# Altium schematic sheet ANALOG_INPUT.SchDoc
size C
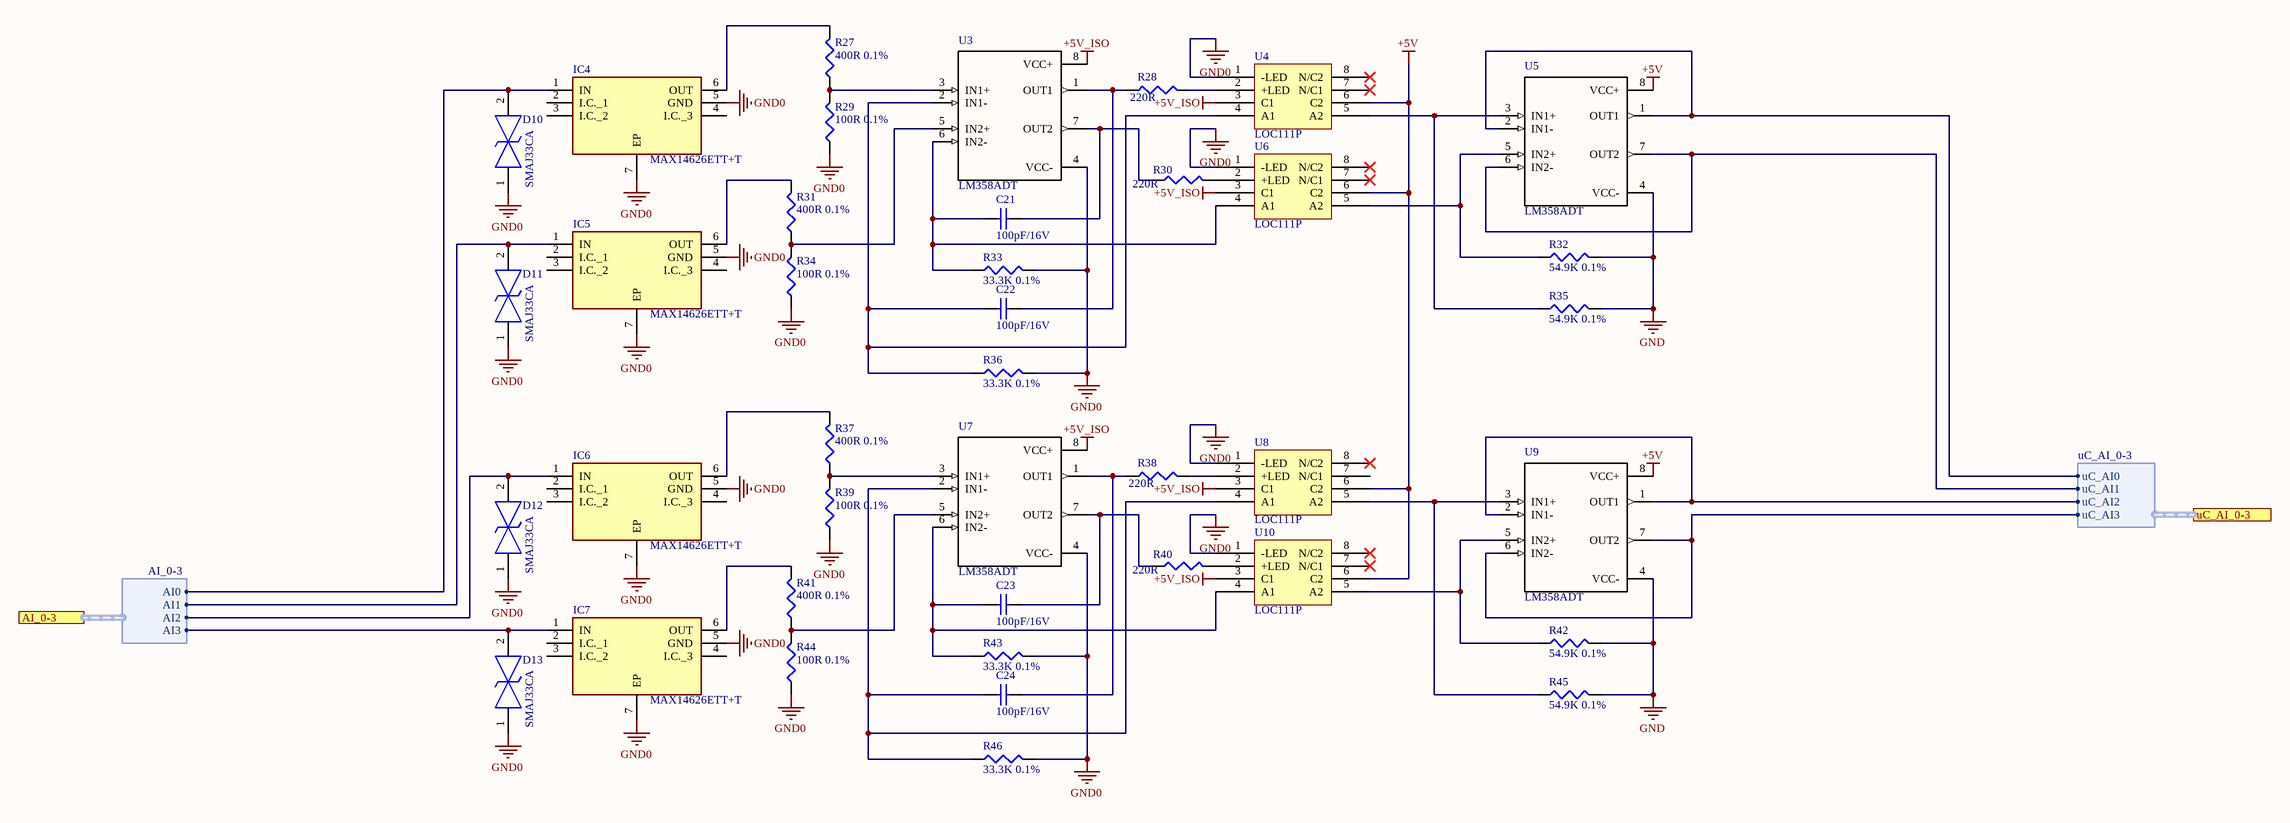
[diagram p0: ANALOG_INPUT.SchDoc]

## Parts
C21  100pF/16V  [1608[0603]]
C22  100pF/16V  [1608[0603]]
C23  100pF/16V  [1608[0603]]
C24  100pF/16V  [1608[0603]]
D10  SMAJ33CA  [DIONM5126X250N]
D11  SMAJ33CA  [DIONM5126X250N]
D12  SMAJ33CA  [DIONM5126X250N]
D13  SMAJ33CA  [DIONM5126X250N]
IC4  MAX14626ETT+T  [SON95P300X300X80-7N]
IC5  MAX14626ETT+T  [SON95P300X300X80-7N]
IC6  MAX14626ETT+T  [SON95P300X300X80-7N]
IC7  MAX14626ETT+T  [SON95P300X300X80-7N]
R27  400R 0.1%  [C1206]
R28  220R  [J1-0603]
R29  100R 0.1%  [C1206]
R30  220R  [J1-0603]
R31  400R 0.1%  [C1206]
R32  54.9K 0.1%  [J1-0603]
R33  33.3K 0.1%  [J1-0603]
R34  100R 0.1%  [C1206]
R35  54.9K 0.1%  [J1-0603]
R36  33.3K 0.1%  [J1-0603]
R37  400R 0.1%  [C1206]
R38  220R  [J1-0603]
R39  100R 0.1%  [C1206]
R40  220R  [J1-0603]
R41  400R 0.1%  [C1206]
R42  54.9K 0.1%  [J1-0603]
R43  33.3K 0.1%  [J1-0603]
R44  100R 0.1%  [C1206]
R45  54.9K 0.1%  [J1-0603]
R46  33.3K 0.1%  [J1-0603]
U3  LM358ADT  [*SOIC127P600X175-8N]
U4  LOC111P  [SOP254P940X265-8N]
U5  LM358ADT  [*SOIC127P600X175-8N]
U6  LOC111P  [SOP254P940X265-8N]
U7  LM358ADT  [*SOIC127P600X175-8N]
U8  LOC111P  [SOP254P940X265-8N]
U9  LM358ADT  [*SOIC127P600X175-8N]
U10  LOC111P  [SOP254P940X265-8N]

## Ports
AI_0-3 (harness AI_0-3), uC_AI_0-3 (harness uC_AI_0-3)

## Harnesses
uC_AI_0-3: uC_AI0, uC_AI1, uC_AI2, uC_AI3
AI_0-3: AI0, AI1, AI2, AI3

## Nets
+5V: U4.6(C2) U5.8(VCC+) U6.6(C2) U8.6(C2) U9.8(VCC+) U10.6(C2)
+5V_ISO: U3.8(VCC+) U4.3(C1) U6.3(C1) U7.8(VCC+) U8.3(C1) U10.3(C1)
GND: R32.2 R35.2 R42.2 R45.2 U5.4(VCC-) U9.4(VCC-)
GND0: D10.1 D11.1 D12.1 D13.1 IC4.5(GND) IC4.7(EP) IC5.5(GND) IC5.7(EP) IC6.5(GND) IC6.7(EP) IC7.5(GND) IC7.7(EP) R29.1 R33.2 R34.1 R36.2 R39.1 R43.2 R44.1 R46.2 U3.4(VCC-) U4.1(-LED) U6.1(-LED) U7.4(VCC-) U8.1(-LED) U10.1(-LED)
NetC21_1: C21.1 R33.1 U3.6(IN2-) U6.4(A1)
NetC21_2: C21.2 R30.1 U3.7(OUT2)
NetC22_1: C22.1 R36.1 U3.2(IN1-) U4.4(A1)
NetC22_2: C22.2 R28.1 U3.1(OUT1)
NetC23_1: C23.1 R43.1 U7.6(IN2-) U10.4(A1)
NetC23_2: C23.2 R40.1 U7.7(OUT2)
NetC24_1: C24.1 R46.1 U7.2(IN1-) U8.4(A1)
NetC24_2: C24.2 R38.1 U7.1(OUT1)
NetD10_2: D10.2 IC4.1(IN) ; port AI_0-3.AI0
NetD11_2: D11.2 IC5.1(IN) ; port AI_0-3.AI1
NetD12_2: D12.2 IC6.1(IN) ; port AI_0-3.AI2
NetD13_2: D13.2 IC7.1(IN) ; port AI_0-3.AI3
NetIC4_6: IC4.6(OUT) R27.2
NetIC5_6: IC5.6(OUT) R31.2
NetIC6_6: IC6.6(OUT) R37.2
NetIC7_6: IC7.6(OUT) R41.2
NetR27_1: R27.1 R29.2 U3.3(IN1+)
NetR28_2: R28.2 U4.2(+LED)
NetR30_2: R30.2 U6.2(+LED)
NetR31_1: R31.1 R34.2 U3.5(IN2+)
NetR32_1: R32.1 U5.5(IN2+) U6.5(A2)
NetR35_1: R35.1 U4.5(A2) U5.3(IN1+)
NetR37_1: R37.1 R39.2 U7.3(IN1+)
NetR38_2: R38.2 U8.2(+LED)
NetR40_2: R40.2 U10.2(+LED)
NetR41_1: R41.1 R44.2 U7.5(IN2+)
NetR42_1: R42.1 U9.5(IN2+) U10.5(A2)
NetR45_1: R45.1 U8.5(A2) U9.3(IN1+)
NetU5_1: U5.1(OUT1) U5.2(IN1-) ; port uC_AI_0-3.uC_AI0
NetU5_6: U5.6(IN2-) U5.7(OUT2) ; port uC_AI_0-3.uC_AI1
NetU9_1: U9.1(OUT1) U9.2(IN1-) ; port uC_AI_0-3.uC_AI2
NetU9_6: U9.6(IN2-) U9.7(OUT2) ; port uC_AI_0-3.uC_AI3

Not connected (* = marked no-connect by the designer): IC4 2(I.C._1) 3(I.C._2) 4(I.C._3); IC5 2(I.C._1) 3(I.C._2) 4(I.C._3); IC6 2(I.C._1) 3(I.C._2) 4(I.C._3); IC7 2(I.C._1) 3(I.C._2) 4(I.C._3); U4 7(N/C1)* 8(N/C2)*; U6 7(N/C1)* 8(N/C2)*; U8 7(N/C1) 8(N/C2)*; U10 7(N/C1)* 8(N/C2)*

## Library data of the parts
C21-C24 = Cap Semi: Capacitor (Semiconductor SIM Model); Published: 8-Jun-2000; LatestRevisionDate: 29-May-2009; LatestRevisionNote: IPC-7351 Footprint Added.; PackageReference: C1206; Publisher: Altium Limited; PackageDescription: Chip Capacitor; Value: 100pF/16V
D10-D13 = SMAJ33CA: TVS Diode (Bi-directional); Manufacturer_Name: LITTELFUSE; Datasheet Link: https://componentsearchengine.com/Datasheets/2/SMAJ33CA.pdf; Height: 2.5mm; Manufacturer_Part_Number: SMAJ33CA; Mouser Part Number: 576-SMAJ33CA; Mouser Price/Stock: https://www.mouser.co.uk/ProductDetail/Littelfuse/SMAJ33CA?qs=JJML70Qc14tynAcWzvnSpg%3D%3D; Arrow Part Number: SMAJ33CA; Arrow Price/Stock: https://www.arrow.com/en/products/smaj33ca/littelfuse?region=nac
IC4-IC7 = MAX14626ETT+T: Integrated Circuit; Manufacturer_Name: Maxim Integrated; Datasheet Link: http://datasheets.maximintegrated.com/en/ds/MAX14626.pdf; Height: 0.8mm; Manufacturer_Part_Number: MAX14626ETT+T; Mouser Part Number: 700-MAX14626ETT+T; Mouser Price/Stock: https://www.mouser.co.uk/ProductDetail/Maxim-Integrated/MAX14626ETT%2bT?qs=Vwh6e7toGLjhMUByPdHdJg%3D%3D
R27 R29 R31 R34 R37 R39 R41 R44 = Res3: Resistor; Value: 500R; Published: 8-Jun-2000; LatestRevisionDate: 29-May-2009; LatestRevisionNote: IPC-7351 Footprint Added.; PackageReference: J1-0603; Publisher: Altium Limited; PackageDescription: Chip Resistor
R28 R30 R38 R40 = Res3: Resistor; Published: 8-Jun-2000; LatestRevisionDate: 29-May-2009; LatestRevisionNote: IPC-7351 Footprint Added.; PackageReference: J1-0603; Publisher: Altium Limited; PackageDescription: Chip Resistor; Value: 220R
R32 R35 R42 R45 = Res3: Resistor; Value: 55K; Published: 8-Jun-2000; LatestRevisionDate: 29-May-2009; LatestRevisionNote: IPC-7351 Footprint Added.; PackageReference: J1-0603; Publisher: Altium Limited; PackageDescription: Chip Resistor
R33 R36 R43 R46 = Res3: Resistor; Value: 167K; Published: 8-Jun-2000; LatestRevisionDate: 29-May-2009; LatestRevisionNote: IPC-7351 Footprint Added.; PackageReference: J1-0603; Publisher: Altium Limited; PackageDescription: Chip Resistor
U3 U5 U7 U9 = LM358ADT: LM358 Series 30 V 1.1 MHz Low Power Dual Operational Amplifier - SOIC-8; MF: STMicroelectronics; SnapEDA_Link: https://www.snapeda.com/parts/LM358ADT/STMicroelectronics/view-part/?ref=snap; MP: LM358ADT; Availability: Unavailable; Price: None; Package: SOIC-8 STMicroelectronics; Value: *
U4 U6 U8 U10 = LOC111P: Linear Optocoupler